# Altium schematic sheet MCU.SchDoc
size B; SheetNumber: 2; SheetTotal: 7
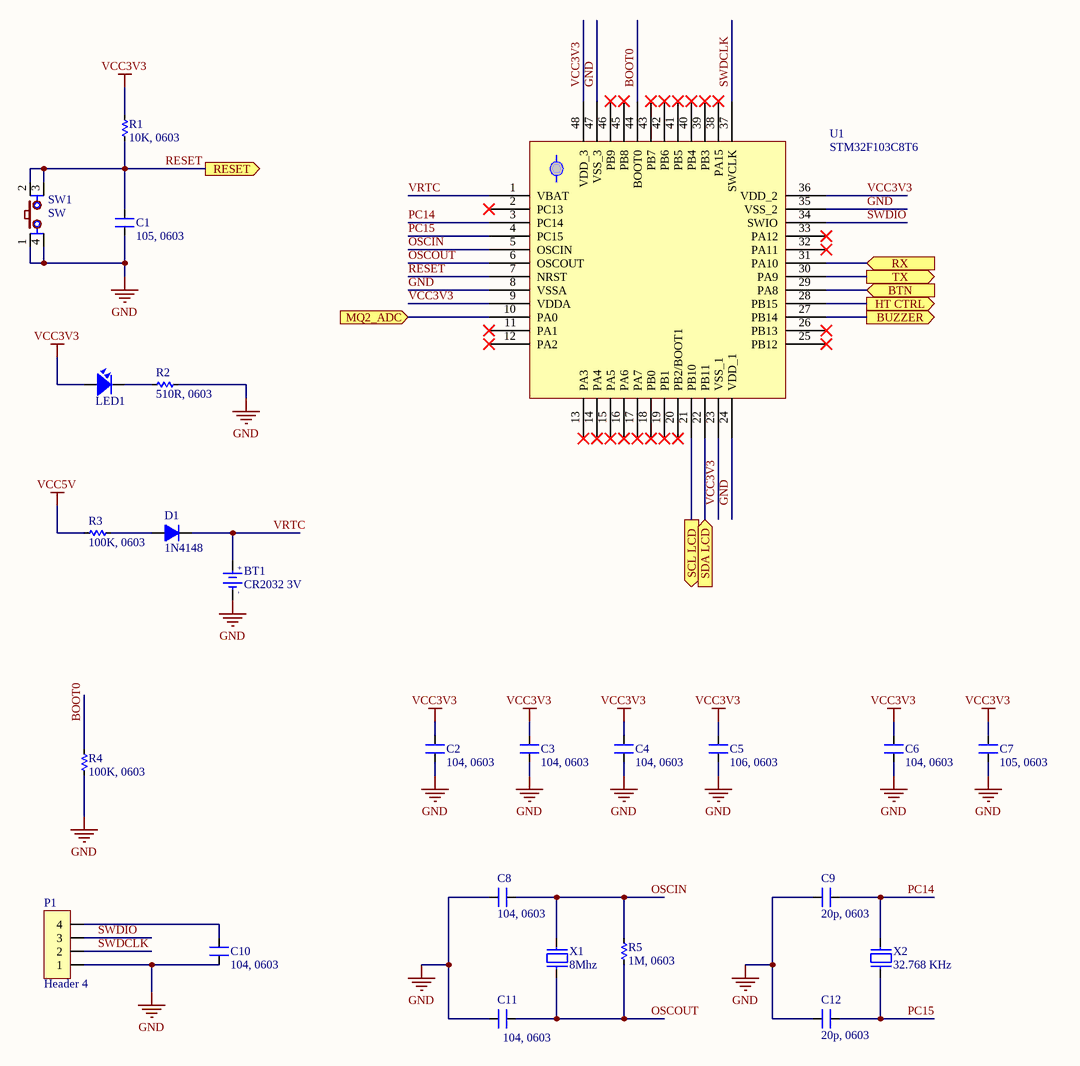
[diagram p0: MCU.SchDoc]

## Parts
BT1  CR2032 3V  [PIN3V]
C1  105, 0603  [SM-0603]
C2  104, 0603  [SM-0603]
C3  104, 0603  [SM-0603]
C4  104, 0603  [SM-0603]
C5  106, 0603  [SM-0603]
C6  104, 0603  [SM-0603]
C7  105, 0603  [SM-0603]
C8  104, 0603  [SM-0603]
C9  20p, 0603  [SM-0603]
C10  104, 0603  [SM-0603]
C11  104, 0603  [SM-0603]
C12  20p, 0603  [SM-0603]
D1  1N4148  [D0.5A]
LED1  LED  [LED-0805-Blue]  (value not drawn)
P1  Header 4  [HDR/Header/4]
R1  10K, 0603  [RES-SMD-0603]
R2  510R, 0603  [RES-SMD-0603]
R3  100K, 0603  [RES-SMD-0603]
R4  100K, 0603  [RES-SMD-0603]
R5  1M, 0603  [RES-SMD-0603]
SW1  SW  [SW2-SMD]
U1  STM32F103C8T6  [QFP50P900X900X160-48N]
X1  8Mhz  [XT2]
X2  32.768 KHz  [XT2-SMD]

## Ports
BTN (in), BUZZER (out), HT CTRL (out), MQ2_ADC (in), RESET (out), RX (in), SCL LCD (out), SDA LCD (in), TX (out)

## Nets
GND: BT1.2(GND) C1.1 C2.1 C3.1 C4.1 C5.1 C6.1 C7.1 C8.1 C9.2 C10.1 C11.2 C12.2 P1.1 R2.2 R4.2 SW1.1 SW1.4 U1.8(VSSA) U1.24(VDD_1) U1.35(VSS_2) U1.47(VSS_3)
VCC3V3: C2.2 C3.2 C4.2 C5.2 C6.2 C7.2 LED1.1 R1.2 U1.9(VDDA) U1.23(VSS_1) U1.36(VDD_2) U1.48(VDD_3)
VCC5V: R3.1
BOOT0: R4.1 U1.44(BOOT0)
BTN: U1.29(PA8) ; port BTN
BUZZER: U1.27(PB14) ; port BUZZER
HT CTRL: U1.28(PB15) ; port HT CTRL
MQ2_ADC: U1.10(PA0) ; port MQ2_ADC
OSCIN: C8.2 R5.1 U1.5(OSCIN) X1.2
OSCOUT: C11.1 R5.2 U1.6(OSCOUT) X1.1
PC14: C9.1 U1.3(PC14) X2.2
PC15: C12.1 U1.4(PC15) X2.1
RESET: C1.2 R1.1 SW1.2 SW1.3 U1.7(NRST) ; port RESET
RX: U1.31(PA10) ; port RX
SCL LCD: U1.21(PB10) ; port SCL LCD
SDA LCD: U1.22(PB11) ; port SDA LCD
SWDCLK: P1.2 U1.37(SWCLK)
SWDIO: P1.3 U1.34(SWIO)
TX: U1.30(PA9) ; port TX
VRTC: BT1.1(+3V) D1.2(K) U1.1(VBAT)
NetC10_2: C10.2 P1.4
NetD1_1: D1.1(A) R3.2
NetLED1_2: LED1.2 R2.1

Not connected (* = marked no-connect by the designer): U1 2(PC13)* 11(PA1)* 12(PA2)* 13(PA3)* 14(PA4)* 15(PA5)* 16(PA6)* 17(PA7)* 18(PB0)* 19(PB1)* 20(PB2/BOOT1)* 25(PB12)* 26(PB13)* 32(PA11)* 33(PA12)* 38(PA15)* 39(PB3)* 40(PB4)* 41(PB5)* 42(PB6)* 43(PB7)* 45(PB8)* 46(PB9)*

## Notes on the sheet
- (in symbol PIN 3V) +; -

## Library data of the parts
BT1 = PIN 3V: CR2032 3VDC rechargeable; Value: PIN 3V
C1-C12 = CM: Cap SMD; Value: 103
D1 = D0.5A: Value: 1N4148
LED1 = LED SMD: Value: LED 3 - 5 ly 2 Colour
P1 = Header 4: Header, 4-Pin
R1-R5 = Res-SMD: Resistor; Manufacturer: Generic Components; Class: Passive; Published: 08/06/2000; Publisher: Altium Hobart Technology Centre
SW1 = SW4: Switch button 4 pin; Value: Button chip 4 pin
X1 = XT2: Crystal For all Crystal 2pin.; Value: 4Mhz
X2 = XT2: Crystal, 32.768 KHz, -40 to 85 degC, 3.2 x 1.5 x 0.9 mm SMD; Value: 4Mhz